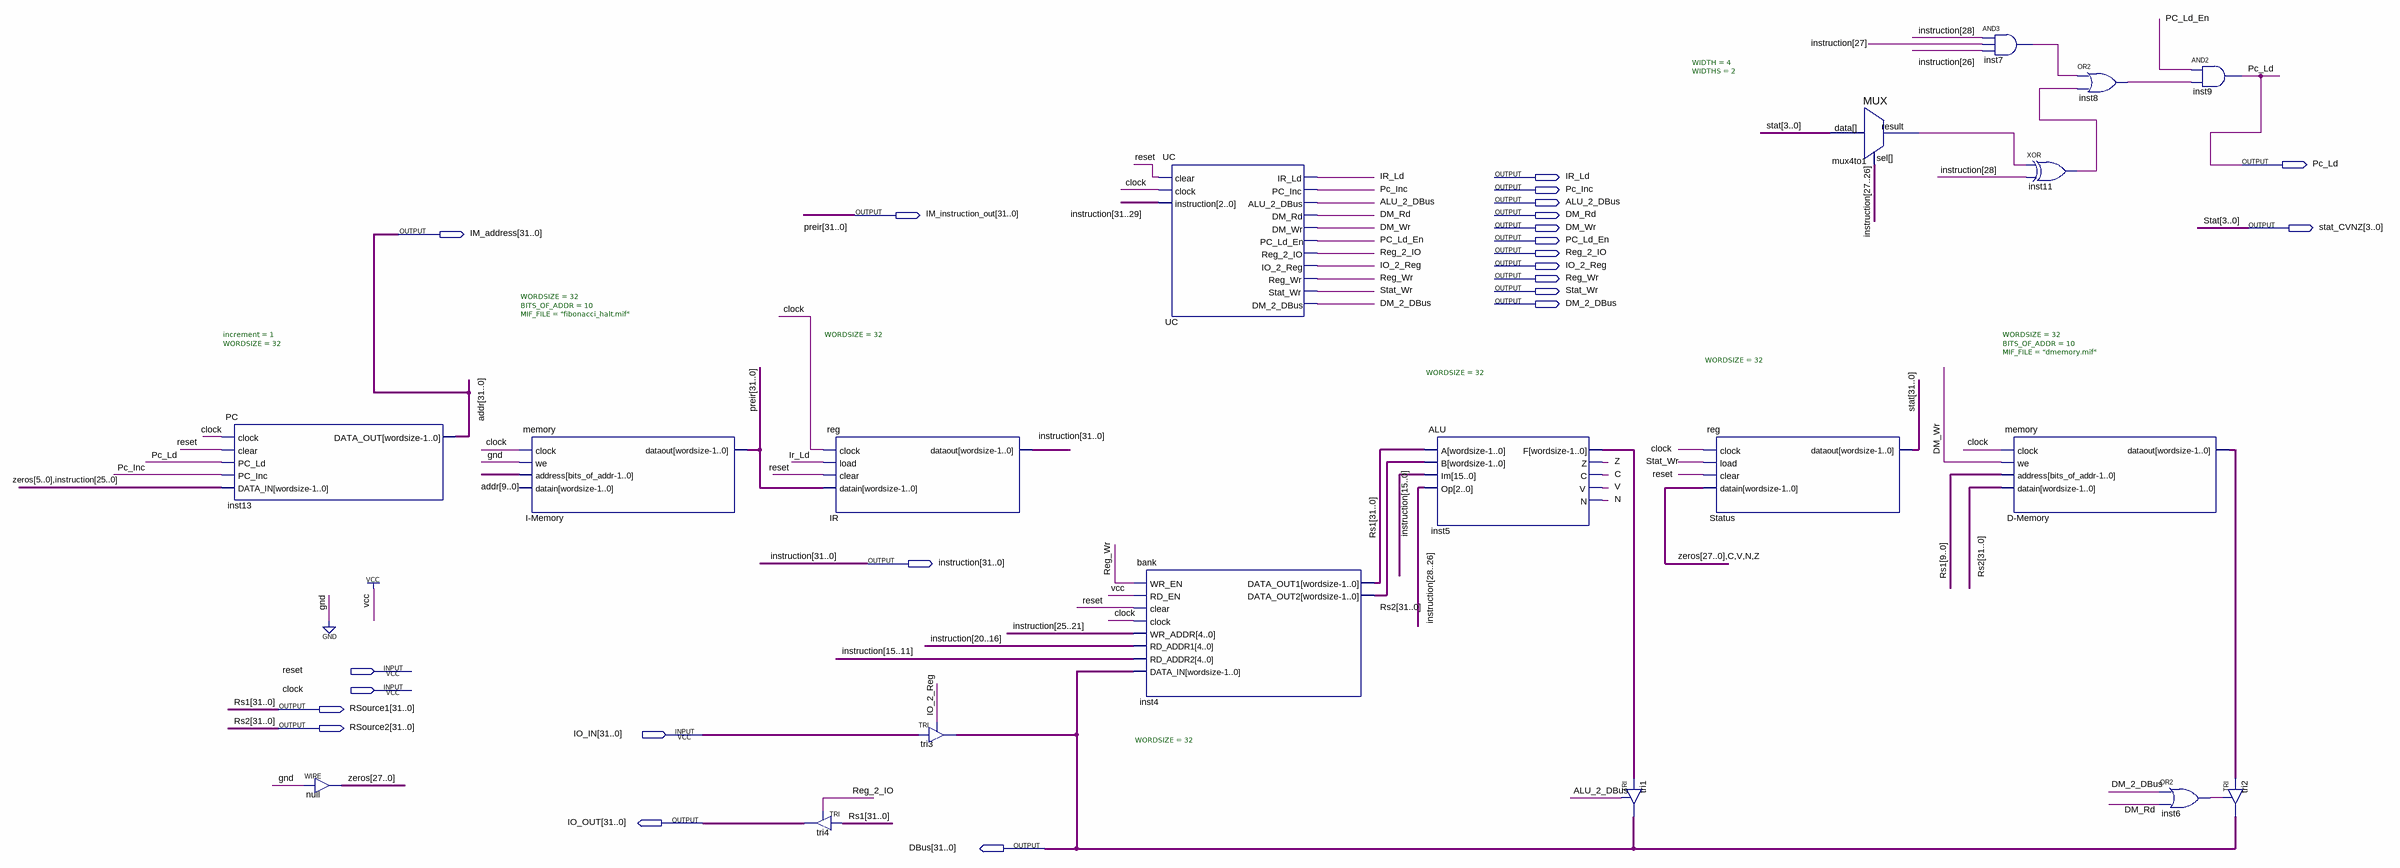
[diagram p0: schematic sheet]
// Quartus schematic CPU.bdf as structural Verilog: 19 symbols, 23 pins
module CPU (
  input  reset,
  input  clock,
  input  [31:0] IO_IN,
  output Pc_Ld,
  output IR_Ld,
  output Pc_Inc,
  output ALU_2_DBus,
  output [31:0] IM_instruction_out,
  output DM_Rd,
  output DM_Wr,
  output [3:0] stat_CVNZ,
  output [31:0] IM_address,
  output PC_Ld_En,
  output Reg_2_IO,
  output IO_2_Reg,
  output Reg_Wr,
  output Stat_Wr,
  output DM_2_DBus,
  output [31:0] instruction,
  output [31:0] RSource1,
  output [31:0] RSource2,
  output [31:0] IO_OUT,
  output [31:0] DBus
);

  wire C, inst6_out, inst7_out, inst8_out, inst11_out, mux4to1_result, N, V, Z;
  wire [27:0] zeros;
  wire [31:0] D_Memory_dataout, inst5_f;
  wire [31:4] stat;

  PC #(.increment(1), .WORDSIZE(32)) inst13 (
    .clock(clock), .clear(reset), .PC_Ld(Pc_Ld), .PC_Inc(Pc_Inc), .DATA_IN({zeros[5:0], instruction[25:0]}),
    .DATA_OUT(IM_address));
  assign zeros = {28{1'b0}};  // WIRE null
  memory #(.WORDSIZE(32), .BITS_OF_ADDR(10), .MIF_FILE("fibonacci_halt.mif")) \I-Memory  (
    .clock(clock), .we(1'b0), .address(IM_address[9:0]), .dataout(IM_instruction_out));  // open: datain
  TRI tri4[31:0] (.IN(RSource1), .OE(Reg_2_IO), .OUT(IO_OUT));
  \reg  #(.WORDSIZE(32)) IR (
    .clock(clock), .load(IR_Ld), .clear(reset), .datain(IM_instruction_out), .dataout(instruction));
  TRI tri3[31:0] (.IN(IO_IN), .OE(IO_2_Reg), .OUT(DBus));
  UC UC (
    .clear(reset), .clock(clock), .instruction(instruction[31:29]), .IR_Ld(IR_Ld), .PC_Inc(Pc_Inc),
    .ALU_2_DBus(ALU_2_DBus), .DM_Rd(DM_Rd), .DM_Wr(DM_Wr), .PC_Ld_En(PC_Ld_En), .Reg_2_IO(Reg_2_IO),
    .IO_2_Reg(IO_2_Reg), .Reg_Wr(Reg_Wr), .Stat_Wr(Stat_Wr), .DM_2_DBus(DM_2_DBus));
  bank #(.WORDSIZE(32)) inst4 (
    .WR_EN(Reg_Wr), .RD_EN(1'b1), .clear(reset), .clock(clock), .WR_ADDR(instruction[25:21]),
    .RD_ADDR1(instruction[20:16]), .RD_ADDR2(instruction[15:11]), .DATA_IN(DBus), .DATA_OUT1(RSource1),
    .DATA_OUT2(RSource2));
  ALU #(.WORDSIZE(32)) inst5 (
    .A(RSource1), .B(RSource2), .Im(instruction[15:0]), .Op(instruction[28:26]), .F(inst5_f), .Z(Z), .C(C),
    .V(V), .N(N));
  TRI \tri1 [31:0] (.IN(inst5_f), .OE(ALU_2_DBus), .OUT(DBus));
  \reg  #(.WORDSIZE(32)) Status (
    .clock(clock), .load(Stat_Wr), .clear(reset), .datain({zeros, C, V, N, Z}), .dataout({stat, stat_CVNZ}));
  MUX #(.WIDTH(4), .WIDTHS(2)) mux4to1 (.data(stat_CVNZ), .sel(instruction[27:26]), .result(mux4to1_result));
  and inst7 (inst7_out, instruction[28], instruction[27], instruction[26]);
  memory #(.WORDSIZE(32), .BITS_OF_ADDR(10), .MIF_FILE("dmemory.mif")) \D-Memory  (
    .clock(clock), .we(DM_Wr), .address(RSource1[9:0]), .datain(RSource2), .dataout(D_Memory_dataout));
  xor inst11 (inst11_out, mux4to1_result, instruction[28]);
  or inst8 (inst8_out, inst7_out, inst11_out);
  or inst6 (inst6_out, DM_2_DBus, DM_Rd);
  and inst9 (Pc_Ld, PC_Ld_En, inst8_out);
  TRI tri2[31:0] (.IN(D_Memory_dataout), .OE(inst6_out), .OUT(DBus));

  // Other names for the same wires on the sheet: addr[31:0] = IM_address; preir[31:0] = IM_instruction_out;
  //   Rs1[31:0] = RSource1; Rs2[31:0] = RSource2; stat[3:0] = stat_CVNZ
endmodule
